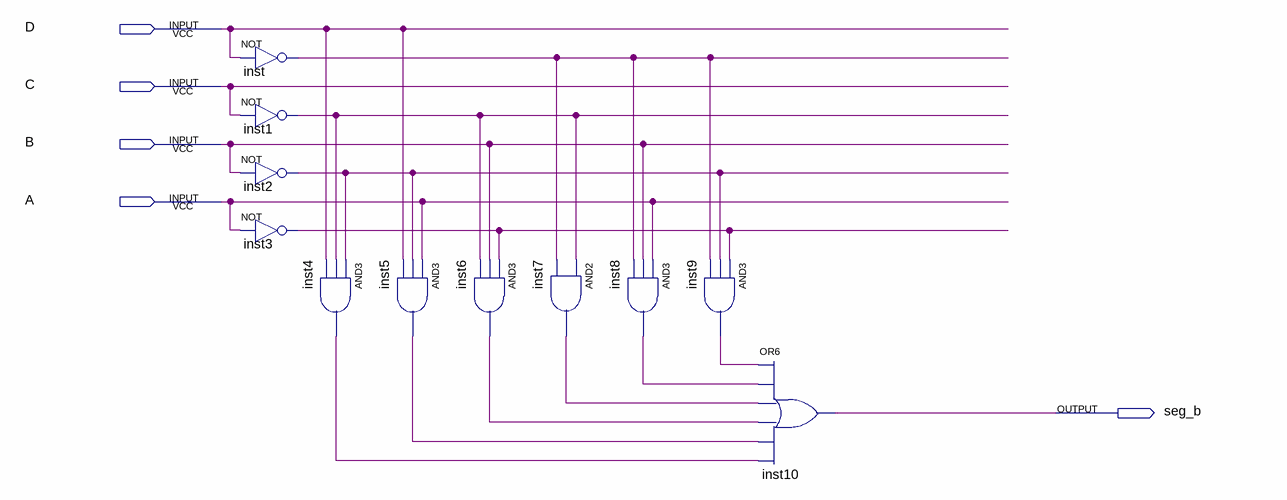
[diagram p0: schematic sheet]
// Quartus schematic seg_b.bdf as structural Verilog: 11 symbols, 5 pins
module seg_b (
  input  D,
  input  C,
  input  B,
  input  A,
  output seg_b
);

  wire inst1_out, inst2_out, inst3_out, inst4_out, inst5_out, inst6_out, inst7_out, inst8_out, inst9_out,
       inst_out;

  not inst (inst_out, D);
  not inst1 (inst1_out, C);
  not inst2 (inst2_out, B);
  not inst3 (inst3_out, A);
  and inst4 (inst4_out, inst2_out, inst1_out, D);
  and inst5 (inst5_out, A, inst2_out, D);
  and inst6 (inst6_out, inst3_out, B, inst1_out);
  and inst7 (inst7_out, inst1_out, inst_out);
  and inst8 (inst8_out, A, B, inst_out);
  and inst9 (inst9_out, inst3_out, inst2_out, inst_out);
  or inst10 (seg_b, inst9_out, inst8_out, inst7_out, inst6_out, inst5_out, inst4_out);
endmodule
